# EAGLE design Ensemble_ProtoBoard (EAGLE 7.6.0)
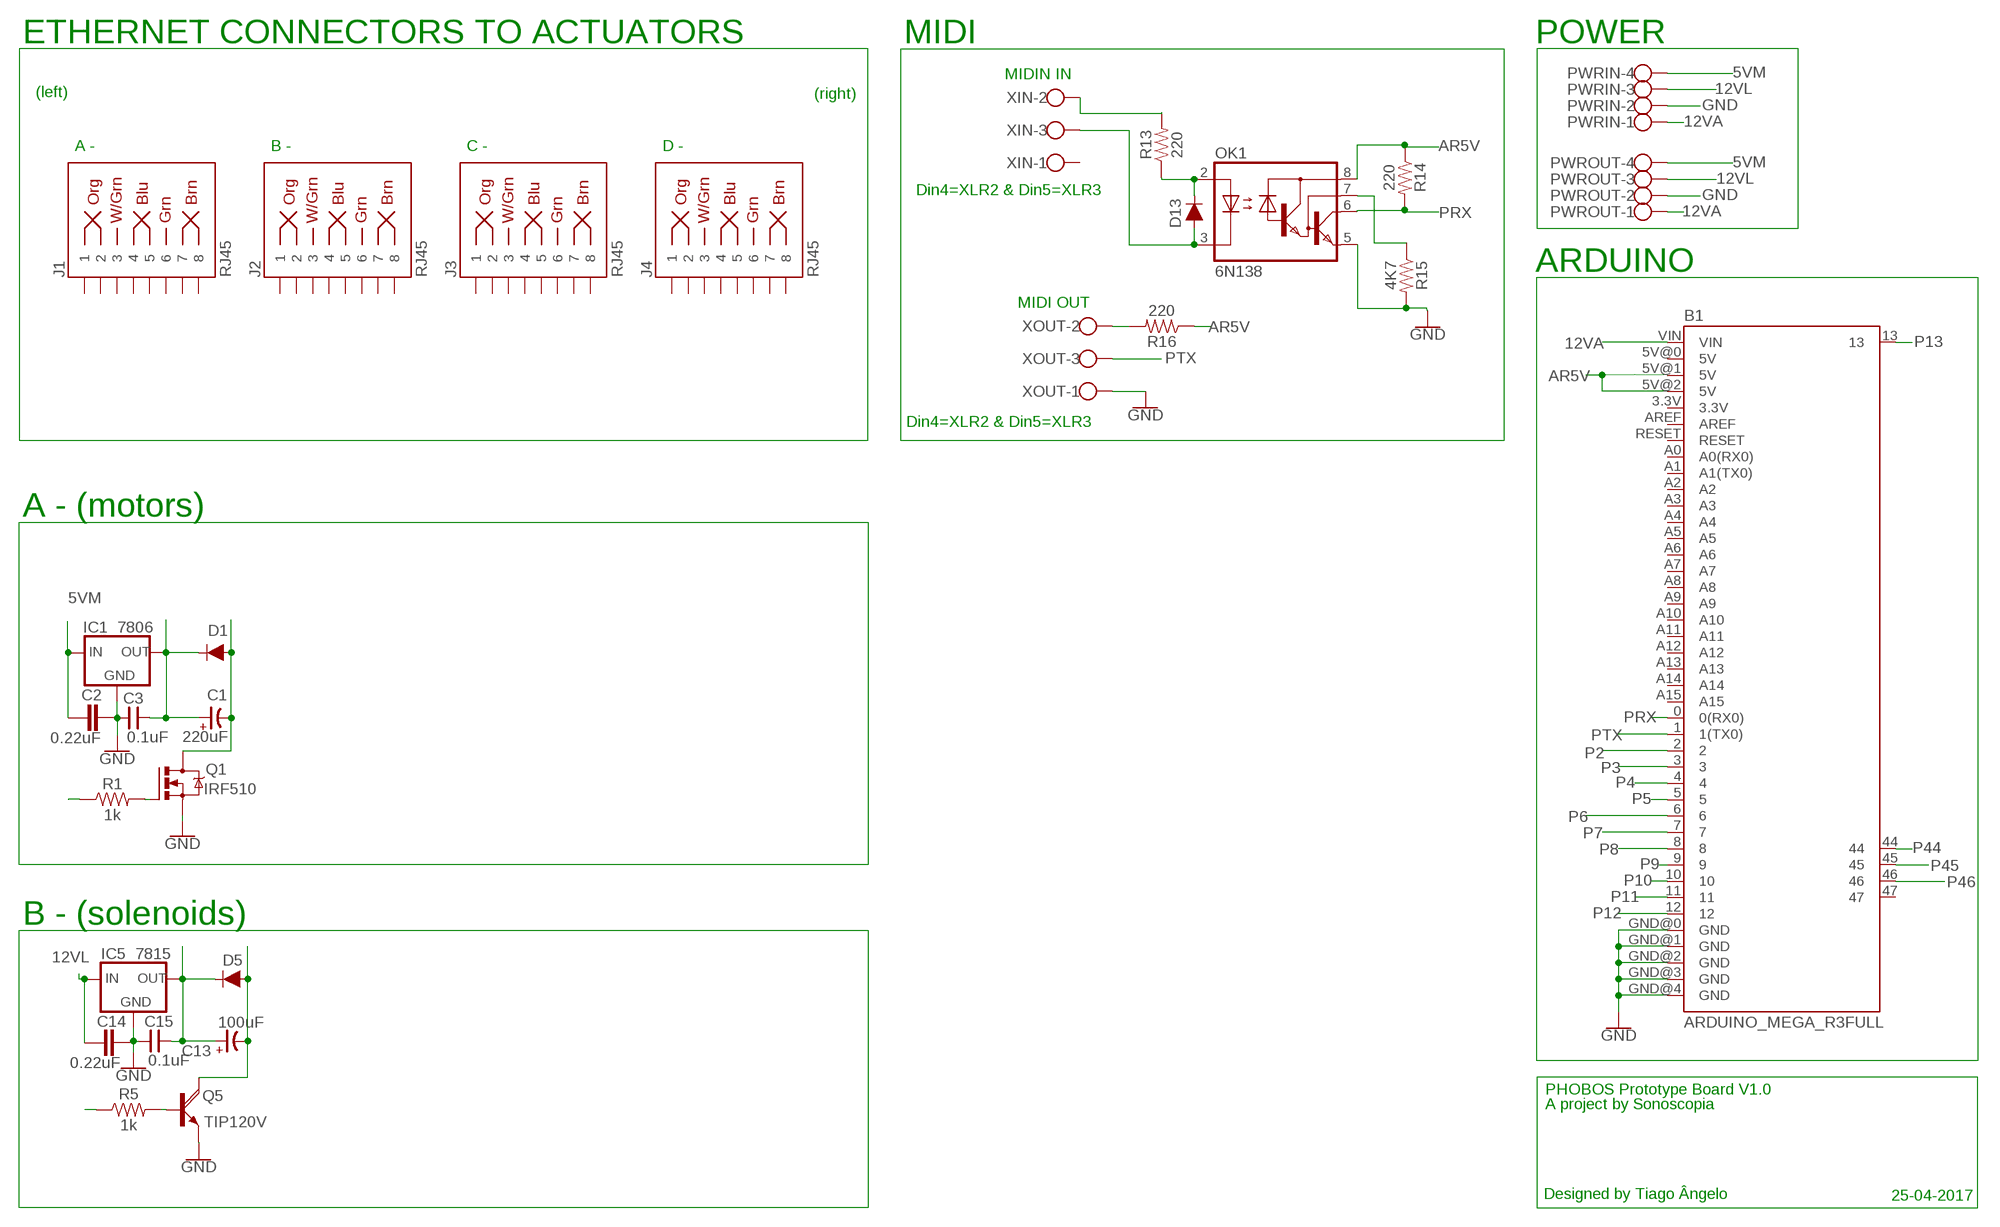
[diagram p0: schematic, sheet 1]

## Parts
B1  ARDUINO_MEGA_R3FULL  [ARDUINO_MEGA]
C1  220uF  CP-E-035X080  [E-035X080]
C2  0.22uF  C5/3  [C5B3]
C3  0.1uF  CNP-C025-050X025  [C025-050X025]
C13  100uF  CP-E-020X050  [E-020X050]
C14  0.22uF  C5/3  [C5B3]
C15  0.1uF  CNP-C025-050X025  [C025-050X025]
D1  1A/50V/1.1V  DIODE-KIT2  [DIODE-1N4001-KIT]
D5  1A/50V/1.1V  DIODE-KIT2  [DIODE-1N4001-KIT]
D13  200mA/100V/1V  DIODE-1N4148  [DIODE-1N4148]
IC1  7806  78XXS  [78XXS]
IC5  7815  78XXS  [78XXS]
J1  RJ45  RJ45-8  [RJ45-8]
J2  RJ45  RJ45-8  [RJ45-8]
J3  RJ45  RJ45-8  [RJ45-8]
J4  RJ45  RJ45-8  [RJ45-8]
OK1  6N138  [DIL08]
PWRIN  W237-4  [W237-4]
PWROUT  W237-4  [W237-4]
Q1  IRF510  IRF520  [TO220BV]
Q5  TIP120V  [TO220AV]
R1  1k  1KOHM-VERT-1/4W-1%  [AXIAL-0.1]
R5  1k  1KOHM-VERT-1/4W-1%  [AXIAL-0.1]
R13  220  1KOHM-HORIZ-1/4W-5%  [AXIAL-0.3]
R14  220  1KOHM-HORIZ-1/4W-5%  [AXIAL-0.3]
R15  4K7  1KOHM-HORIZ-1/4W-5%  [AXIAL-0.3]
R16  220  1KOHM-HORIZ-1/4W-5%  [AXIAL-0.3]
XIN  W237-103  [W237-103]
XOUT  W237-103  [W237-103]

## Nets
5VM [5VM]: C2.1 IC1.IN PWRIN.4 PWROUT.4
12VA [12VA]: B1.VIN PWRIN.1 PWROUT.1
12VL [12VL]: C14.1 IC5.IN PWRIN.3 PWROUT.3
AR5V: B1.5V@1(5V) B1.5V@2(5V) OK1.8(VCC) R14.P$1 R16.P$1
GND [GND]: B1.GND@0(GND) B1.GND@1(GND) B1.GND@2(GND) B1.GND@3(GND) B1.GND@4(GND) C2.2 C3.1 C14.2 C15.1 IC1.GND IC5.GND OK1.5(GND) PWRIN.2 PWROUT.2 Q1.S Q5.E R15.P$2 XOUT.1
N$1: C1.+ C3.2 D1.C IC1.OUT Q1.G R1.P$2
N$2: C1.- D1.A Q1.D R16.P$2 XOUT.2
N$3: R1.P$1
N$4 [12VL]: C13.+ C15.2 D5.C IC5.OUT
N$5 [12VL]: C13.- D5.A Q5.C
N$9: Q5.B R5.P$2
N$25: D13.A OK1.3(C) XIN.3
N$26: D13.C OK1.2(A) R13.P$1
N$27: R13.P$2 XIN.2
N$29: OK1.7(VB) R15.P$1
N$600: R5.P$1
P2: B1.2
P3: B1.3
P4: B1.4
P5: B1.5
P6: B1.6
P7: B1.7
P8: B1.8
P9: B1.9
P10: B1.10
P11: B1.11
P12: B1.12
P13: B1.13
P44: B1.44
P45: B1.45
P46: B1.46
PRX: B1.0(0(RX0)) OK1.6(VO) R14.P$2
PTX: B1.1(1(TX0)) XOUT.3
Unconnected: B1.3.3V B1.5V@0(5V) B1.47 B1.A0(A0(RX0)) B1.A1(A1(TX0)) B1.A2 B1.A3 B1.A4 B1.A5 B1.A6 B1.A7 B1.A8 B1.A9 B1.A10 B1.A11 B1.A12 B1.A13 B1.A14 B1.A15 B1.AREF B1.RESET J1.1 J1.2 J1.3 J1.4 J1.5 J1.6 J1.7 J1.8 J2.1 J2.2 J2.3 J2.4 J2.5 J2.6 J2.7 J2.8 J3.1 J3.2 J3.3 J3.4 J3.5 J3.6 J3.7 J3.8 J4.1 J4.2 J4.3 J4.4 J4.5 J4.6 J4.7 J4.8 XIN.1

## Notes on the sheet
- ETHERNET CONNECTORS TO ACTUATORS | MIDI | POWER
- MIDIN IN
- (left) | (right)
- A - | B - | C - | D -
- Din4=XLR2 & Din5=XLR3
- ARDUINO
- MIDI OUT
- Din4=XLR2 & Din5=XLR3
- A - (motors)
- B - (solenoids)
- PHOBOS Prototype Board V1.0
- A project by Sonoscopia
- Designed by Tiago Ângelo | 25-04-2017

## Library data of the parts
B1 = PHOBOS-Boards:ARDUINO_MEGA_R3: Arduino Mega R3 ATmega2560 R3 compatible footprint. SparkFun Products: Arduino Mega 2560 R3 <https://www.sparkfun.com/products/11061>
C1 C13 = cap-master:CP-: POLARIZED CAP
C2 C14 = capacitor-wima:C: CAPACITOR naming: grid - package width
C3 C15 = cap-master:CNP-: NON-POLARIZED CAP
D1 D5 = SparkFun-DiscreteSemi:DIODE: Diode These are standard reverse protection diodes and small signal diodes. SparkFun Products: SparkFun SparkPunk Sound Kit <https://www.sparkfun.com/products/11177> SparkFun ESP8266 Thing <https://www.sparkfun.com/products/13231>; PROD_ID: DIO-09176
D13 = SparkFun-DiscreteSemi:DIODE: Diode These are standard reverse protection diodes and small signal diodes. SparkFun Products: SparkFun SparkPunk Sound Kit <https://www.sparkfun.com/products/11177> SparkFun ESP8266 Thing <https://www.sparkfun.com/products/13231>; PROD_ID: DIO-08378
IC1 IC5 = v-reg:78XXS: VOLTAGE REGULATOR
J1-J4 = SparkFun-Connectors:RJ45-8: RJ45 Jack - 8 pin Simple RJ45, 8-pin connection. Commonly used for Cat5, Cat5e, and Cat6 Ethernet cables. Here is the connector we sell at SparkFun: RJ45 8-Pin Connector <https://www.sparkfun.com/products/643> (PRT-00643) Datasheet <https://cdn.sparkfun.com/datasheets/Prototyping/04908.pdf> It is used on this SparkFun product: SparkFun RJ45 Breakout <https://www.sparkfun.com/products/716> (BOB-00716) Note, you may also be interested in the "MAGJACK" version of this. It is basically a RJ45 connector, but also has some status LEDs built into the connector housing. You can check that out in this library at the device named "MAGJACK.dev" and see these products online: RJ45 Ethernet MagJack-Compatible <https://www.sparkfun.com/products/8534> (PRT-08534) SparkFun RJ45 MagJack Breakout <https://www.sparkfun.com/products/13021> (BOB-13021); PROD_ID: CONN-08506; SF_ID: PRT-00643
OK1 = optocoupler:6N138: MOTOROLA OPTO COUPLER; MF: VISHAY/TELEFUNKEN; MPN: 6N138; OC_FARNELL: 9860150; OC_NEWARK: 35K5294
PWRIN PWROUT = con-wago-500:W237-4: WAGO SCREW CLAMP; OC_FARNELL: unknown; OC_NEWARK: unknown
Q1 = transistor-power:IRF520: HEXFET Power MOSFET
Q5 = rocketfarm:TIP120: NPN DARLINGTON TRANSISTOR
R1 R5 = SparkFun-Resistors:1KOHM: 1kΩ resistor A resistor is a passive two-terminal electrical component that implements electrical resistance as a circuit element. Resistors act to reduce current flow, and, at the same time, act to lower voltage levels within circuits. - Wikipedia; PROD_ID: RES-12182
R13-R16 = SparkFun-Resistors:1KOHM: 1kΩ resistor A resistor is a passive two-terminal electrical component that implements electrical resistance as a circuit element. Resistors act to reduce current flow, and, at the same time, act to lower voltage levels within circuits. - Wikipedia; PROD_ID: RES-08380; VALUE: 1k
XIN XOUT = con-wago-500:W237-103: WAGO SCREW CLAMP; MPN: 237-103; OC_FARNELL: unknown; OC_NEWARK: 18M7116

## Net classes
0 default: width 0.406 mm, drill 0.508 mm, clearance 0.406 mm
1 GND: width 0.61 mm, drill 0.508 mm, clearance 0.508 mm
2 5VM: width 0.61 mm, drill 0.508 mm, clearance 0.508 mm
3 12VL: width 0.508 mm, drill 0.508 mm, clearance 0.508 mm
4 12VA: width 0.305 mm, drill 0.508 mm, clearance 0.508 mm

## Board
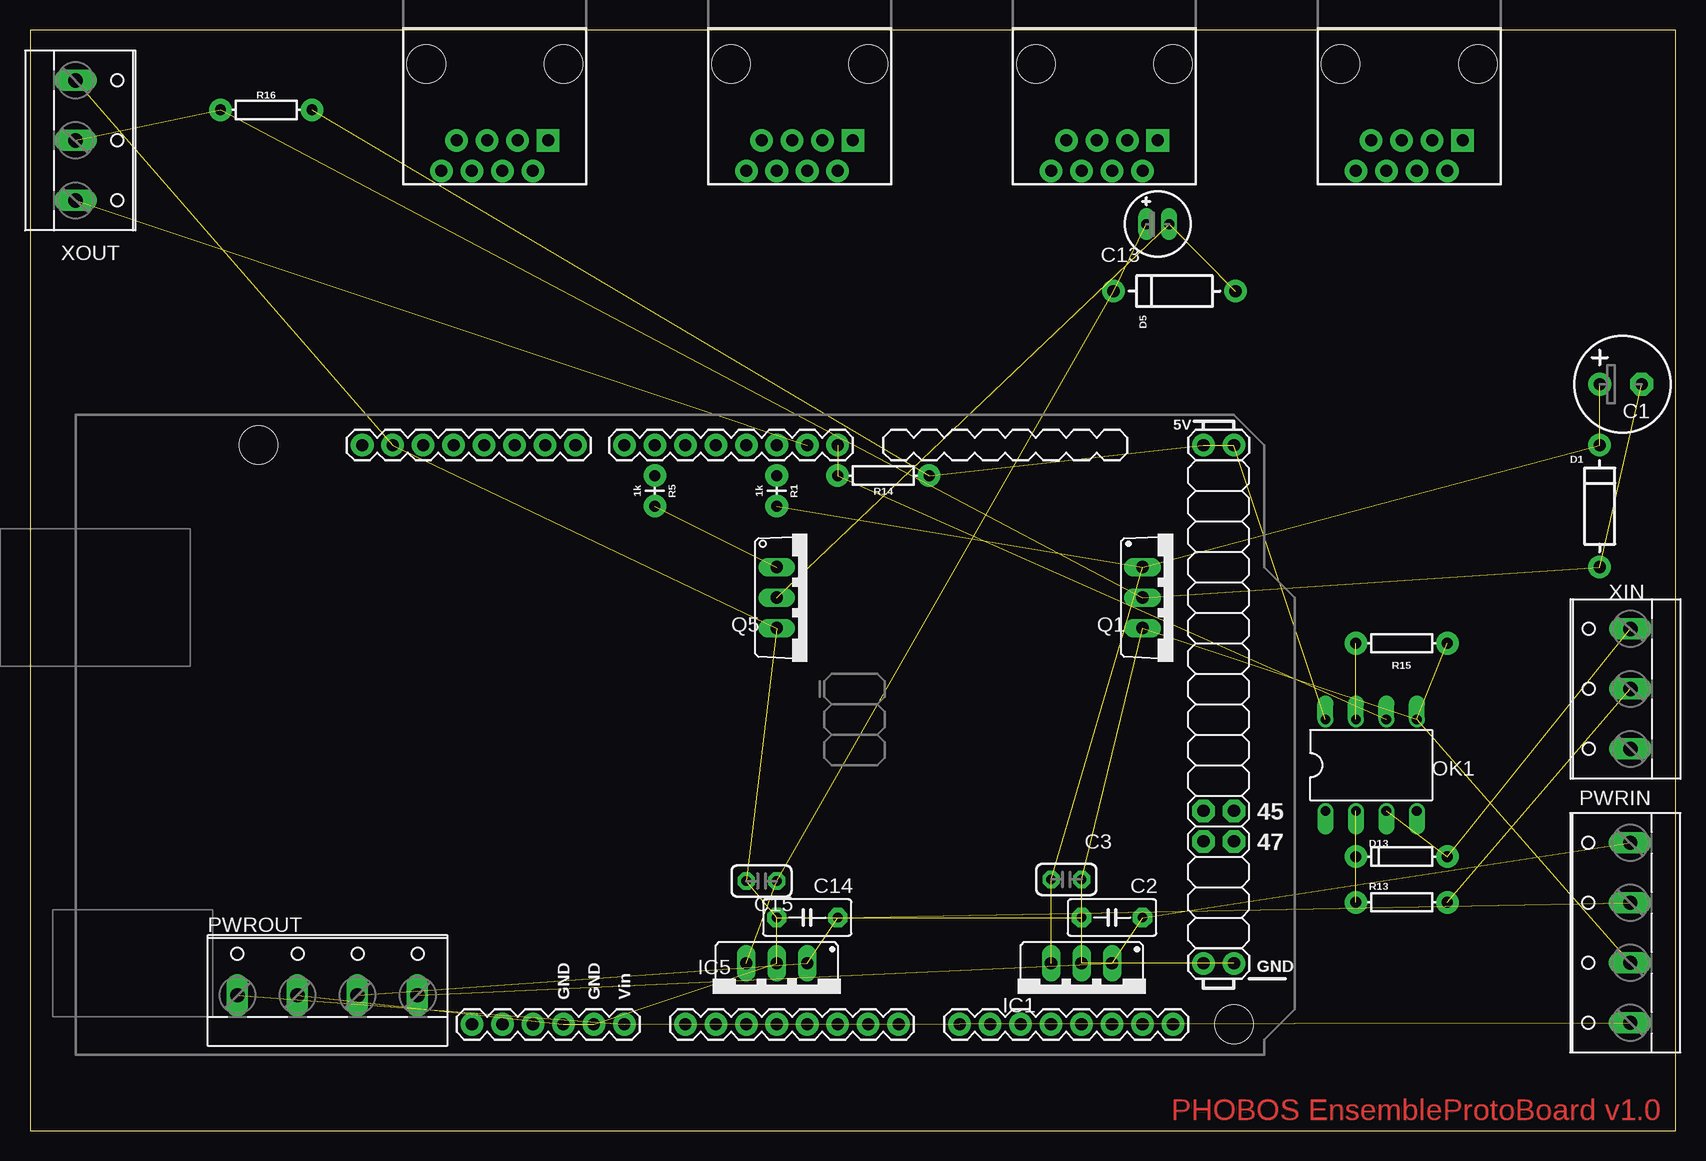
[diagram p1: board, top side]
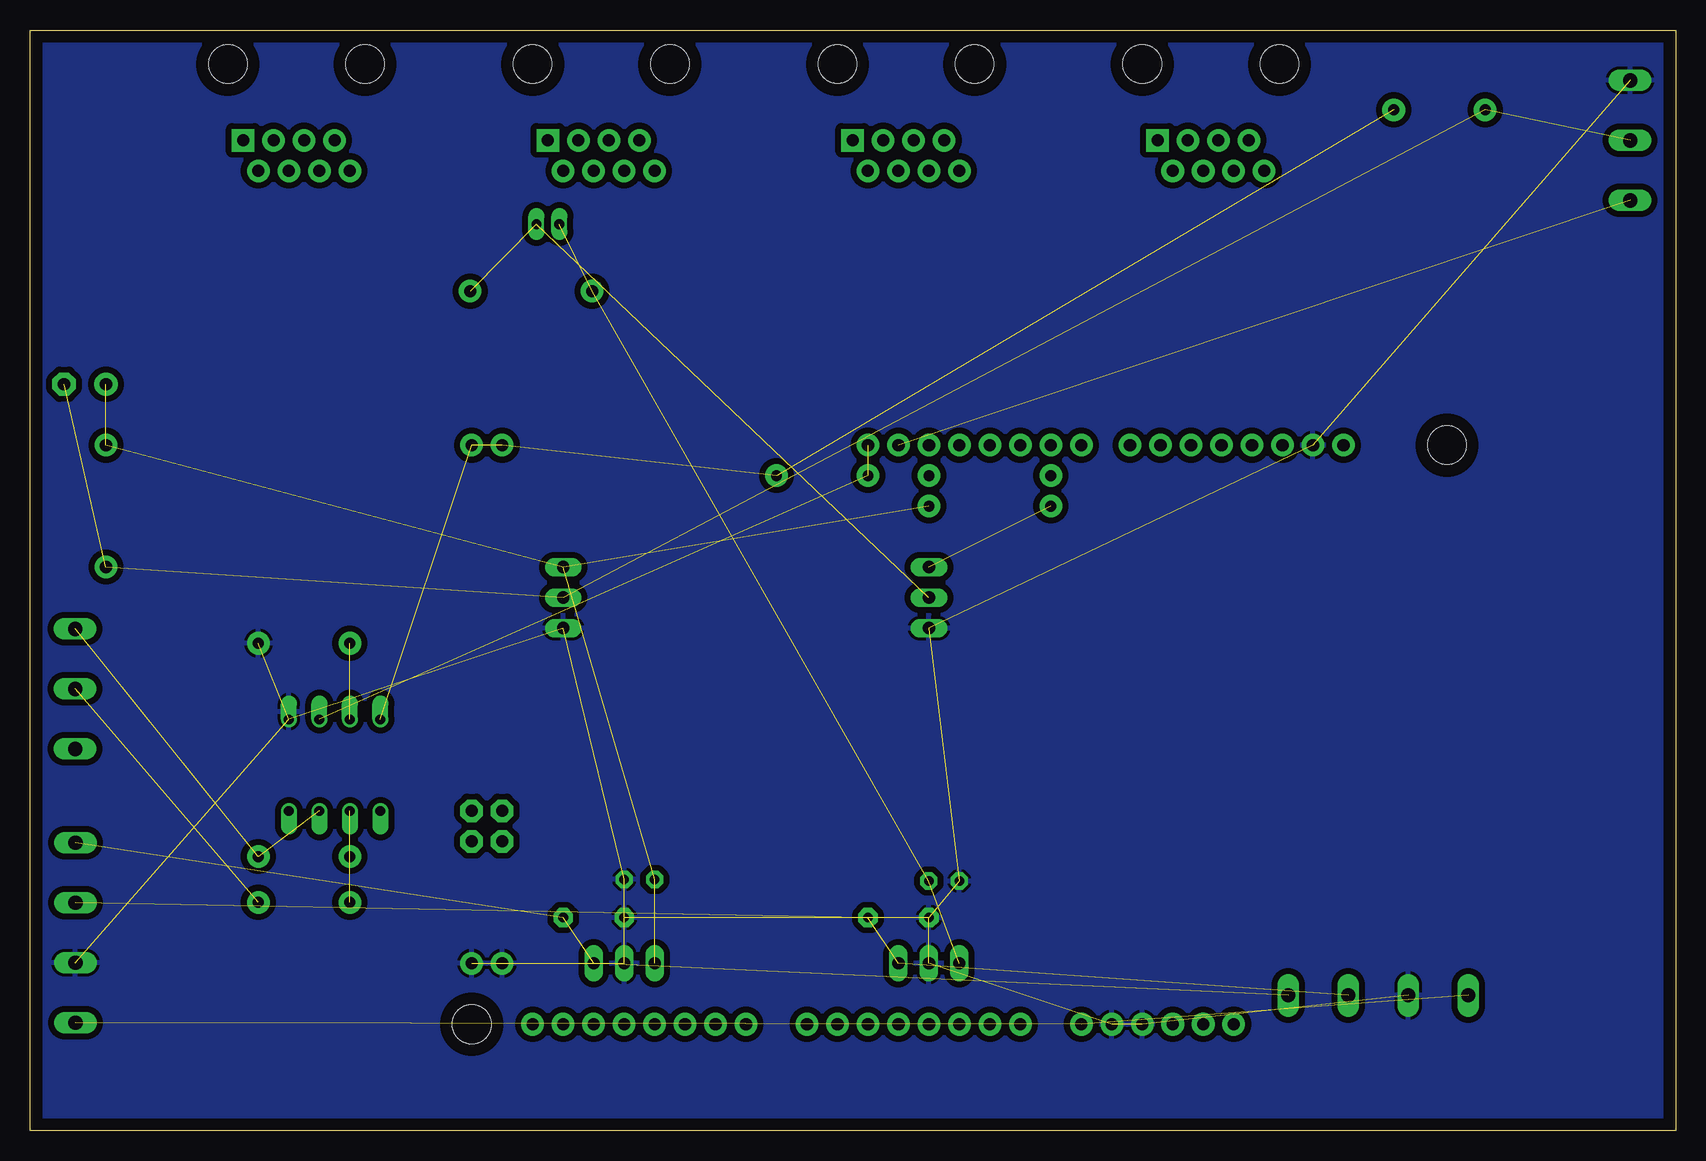
[diagram p2: board, bottom side, seen from below]

Size 137.14 x 91.75 mm. Coordinates in mm from the lower left corner, seen from the top.
Outline: 0,0 137.14,0 137.14,91.75 0,91.75 0,0
Copper layers (1*16): Top 0.035mm / dielectric 1.5mm / Bottom 0.035mm
Design rules "default": minimum track width 10mil, minimum drill 24mil, track to track 8mil, track to pad 8mil, pad to pad 8mil, via to via 8mil, smd to smd 8mil, copper to edge 40mil, drill to drill 8mil, minimum pad ring 10mil, minimum via ring 8mil, stop-mask expansion 4mil, vias tented up to drill 0mil, thermal gap 10mil

### Footprints (pad centres in the part's own frame; a part is rotated, then mirrored left to right if it is on the bottom)
ARDUINO_MEGA = drill 1.016 pad 1.88: 0 13.97,24.13; 1 11.43,24.13; 2 8.89,24.13; 3 6.35,24.13; 3.3V -13.97,-24.13; 4 3.81,24.13; 5 1.27,24.13; 5V@0 -11.43,-24.13; 5V@1 44.45,24.13; 5V@2 46.99,24.13; 6 -1.27,24.13; 7 -3.81,24.13; 8 -7.874,24.13; 9 -10.414,24.13; 10 -12.954,24.13; 11 -15.494,24.13; 12 -18.034,24.13; 13 -20.574,24.13; A0 1.27,-24.13; A1 3.81,-24.13; A2 6.35,-24.13; A3 8.89,-24.13; A4 11.43,-24.13; A5 13.97,-24.13; A6 16.51,-24.13; A7 19.05,-24.13; A8 24.13,-24.13; A9 26.67,-24.13; A10 29.21,-24.13; A11 31.75,-24.13; A12 34.29,-24.13; A13 36.83,-24.13; A14 39.37,-24.13; A15 41.91,-24.13; AREF -25.654,24.13; GND@0 -8.89,-24.13; GND@1 -6.35,-24.13; GND@2 44.45,-19.05; GND@3 46.99,-19.05; GND@4 -23.114,24.13; RESET -16.51,-24.13; VIN -3.81,-24.13 | drill 1.016 pad 1.88 octagon: 44 44.45,-6.35; 45 46.99,-6.35; 46 44.45,-8.89; 47 46.99,-8.89 | hole 3.2: -34.29,24.13; 46.99,-24.13
E-035X080 = drill 1.016 pad 1.93: + -1.905,0 | drill 1.016 pad 1.93 octagon: - 1.587,0
C5B3 = drill 0.813 pad 1.6 octagon: 1 -2.54,0; 2 2.54,0
C025-050X025 = drill 0.813 pad 1.422 octagon: 1 -1.27,0; 2 1.27,0
E-020X050 = drill 0.813 long: + -0.953,0; - 0.953,0
DIODE-1N4001-KIT = drill 1.016 pad 1.88: A -5.08,0; C 5.08,0
DIODE-1N4148 = drill 0.9 pad 1.88: A -3.81,0; C 3.81,0
78XXS = drill 1.016 long: GND 0,-2.54; IN -2.54,-2.54; OUT 2.54,-2.54
RJ45-8 = drill 1 pad 1.88 square: 1 -4.445,6.35 | drill 1 pad 1.88: 2 -3.175,8.89; 3 -1.905,6.35; 4 -0.635,8.89; 5 0.635,6.35; 6 1.905,8.89; 7 3.175,6.35; 8 4.445,8.89 | hole 3.2: -5.715,0; 5.715,0
DIL08 = drill 0.813 offset: 1 -3.81,-3.81; 2 -1.27,-3.81; 3 1.27,-3.81; 4 3.81,-3.81; 5 3.81,3.81; 6 1.27,3.81; 7 -1.27,3.81; 8 -3.81,3.81
W237-4 = drill 1.194 long: 1 -7.5,-1.27; 2 -2.5,-1.27; 3 2.5,-1.27; 4 7.5,-1.27
TO220BV = drill 1.016 long: D 0,-2.54; G -2.54,-2.54; S 2.54,-2.54
TO220AV = drill 1.016 long: B -2.54,-2.54; C 0,-2.54; E 2.54,-2.54
AXIAL-0.1 = drill 0.9 pad 1.88: P$1 -1.27,0; P$2 1.27,0
AXIAL-0.3 = drill 0.9 pad 1.88: P$1 -3.81,0; P$2 3.81,0
W237-103 = drill 1.194 long: 1 -5,-1.29; 2 0,-1.29; 3 5,-1.29

### Placement (x,y rotation side)
B1  53.34,33.02 0 top
C1  132.72,62.23 0 top
C2  90.17,17.78 180 top
C3  86.36,20.95 180 top
C13  93.98,75.56 0 top
C14  64.77,17.78 180 top
C15  60.96,20.83 0 top
D1  130.81,52.07 90 top
D5  95.38,69.98 180 top
D13  114.3,22.86 180 top
IC1  87.63,11.43 180 top
IC5  62.23,11.43 180 top
J1  114.94,88.9 180 top
J2  89.53,88.9 180 top
J3  64.14,88.9 180 top
J4  38.73,88.9 180 top
OK1  111.76,30.48 0 top
PWRIN  132.08,16.51 90 top
PWROUT  24.79,12.57 0 top
Q1  95.25,44.45 270 top
Q5  64.77,44.45 270 top
R1  62.23,53.34 270 top
R5  52.07,53.34 270 top
R13  114.3,19.05 0 top
R14  71.12,54.61 180 top
R15  114.3,40.64 0 top
R16  19.68,85.09 180 top
XIN  132.08,36.83 90 top
XOUT  5.08,82.55 270 top

### Tracks (layer width: path | path; a pad name or v marks a point on that pad's centre or on a via)
5VM  (3 unrouted)
12VA  (2 unrouted)
12VL  (3 unrouted)
AR5V  (4 unrouted)
GND  (17 unrouted)
  pour Bottom: -12.7,106.68 149.86,106.68 149.86,-10.16 -10.16,-10.16 -12.7,-10.16
N$1  (5 unrouted)
N$2  (4 unrouted)
N$4  (3 unrouted)
N$5  (2 unrouted)
N$9  (1 unrouted)
N$25  (2 unrouted)
N$26  (2 unrouted)
N$27  (1 unrouted)
N$29  (1 unrouted)
PRX  (2 unrouted)
PTX  (1 unrouted)

### Text on the board
Top: PHOBOS EnsembleProtoBoard v1.0